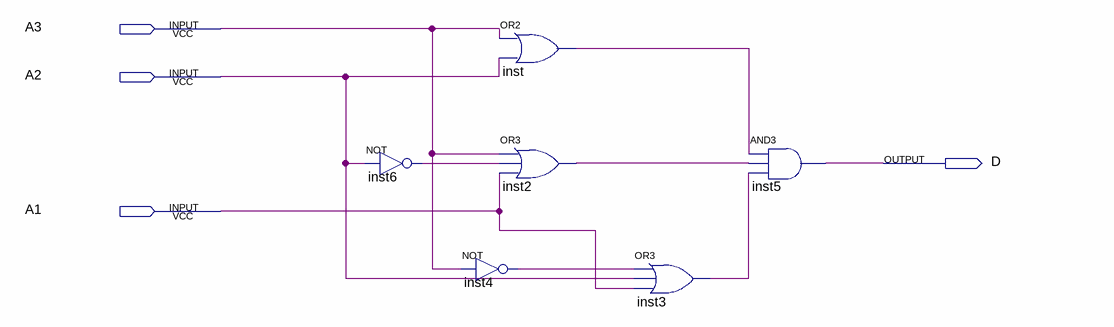
[diagram p0: schematic sheet]
// Quartus schematic exercicio_3.bdf as structural Verilog: 6 symbols, 4 pins
module exercicio_3 (
  input  A3,
  input  A2,
  input  A1,
  output D
);

  wire inst2_out, inst3_out, inst4_out, inst6_out, inst_out;

  not inst6 (inst6_out, A2);
  not inst4 (inst4_out, A3);
  or inst (inst_out, A3, A2);
  or inst2 (inst2_out, A3, inst6_out, A1);
  or inst3 (inst3_out, inst4_out, A2, A1);
  and inst5 (D, inst_out, inst2_out, inst3_out);
endmodule
